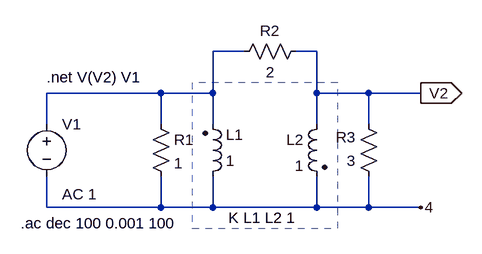
[diagram p0: schematic Ejercicio1.asc]
Ejercicio1.asc, the LTspice schematic file:
Version 4
SHEET 1 880 680
WIRE 304 16 256 16
WIRE 416 16 384 16
WIRE 176 80 0 80
WIRE 256 80 256 16
WIRE 256 80 176 80
WIRE 416 80 416 16
WIRE 496 80 416 80
WIRE 576 80 496 80
WIRE 0 128 0 80
WIRE 176 128 176 80
WIRE 256 128 256 80
WIRE 416 128 416 80
WIRE 496 128 496 80
WIRE 0 256 0 208
WIRE 176 256 176 208
WIRE 176 256 0 256
WIRE 256 256 256 208
WIRE 256 256 176 256
WIRE 416 256 416 208
WIRE 416 256 256 256
WIRE 496 256 496 208
WIRE 496 256 416 256
WIRE 576 256 496 256
FLAG 576 256 4
FLAG 576 80 V2
IOPIN 576 80 Out
SYMBOL voltage 0 112 R0
WINDOW 123 24 124 Left 2
WINDOW 39 0 0 Left 0
SYMATTR InstName V1
SYMATTR Value ""
SYMATTR Value2 AC 1
SYMBOL res 160 112 R0
SYMATTR InstName R1
SYMATTR Value 1
SYMBOL res 400 0 R90
WINDOW 0 0 56 VBottom 2
WINDOW 3 32 56 VTop 2
SYMATTR InstName R2
SYMATTR Value 2
SYMBOL res 512 224 R180
WINDOW 0 36 76 Left 2
WINDOW 3 36 40 Left 2
SYMATTR InstName R3
SYMATTR Value 3
SYMBOL ind2 240 224 M180
WINDOW 0 36 80 Left 2
WINDOW 3 36 40 Left 2
SYMATTR InstName L1
SYMATTR Value 1
SYMATTR Type ind
SYMBOL ind2 432 112 M0
SYMATTR InstName L2
SYMATTR Value 1
SYMATTR Type ind
TEXT 0 56 Left 2 !.net V(V2) V1
TEXT 280 272 Left 2 !K L1 L2 1
TEXT -40 280 Left 2 !.ac dec 100 0.001 100
RECTANGLE Normal 448 64 224 288 3

The netlist it stands for:
* Ejercicio1.asc
V1 N001 4 AC 1
R1 N001 4 1
R2 V2 N001 2
R3 4 V2 3
L1 4 N001 1
L2 V2 4 1
.net V(V2) V1
K L1 L2 1
.ac dec 100 0.001 100
.backanno
.end